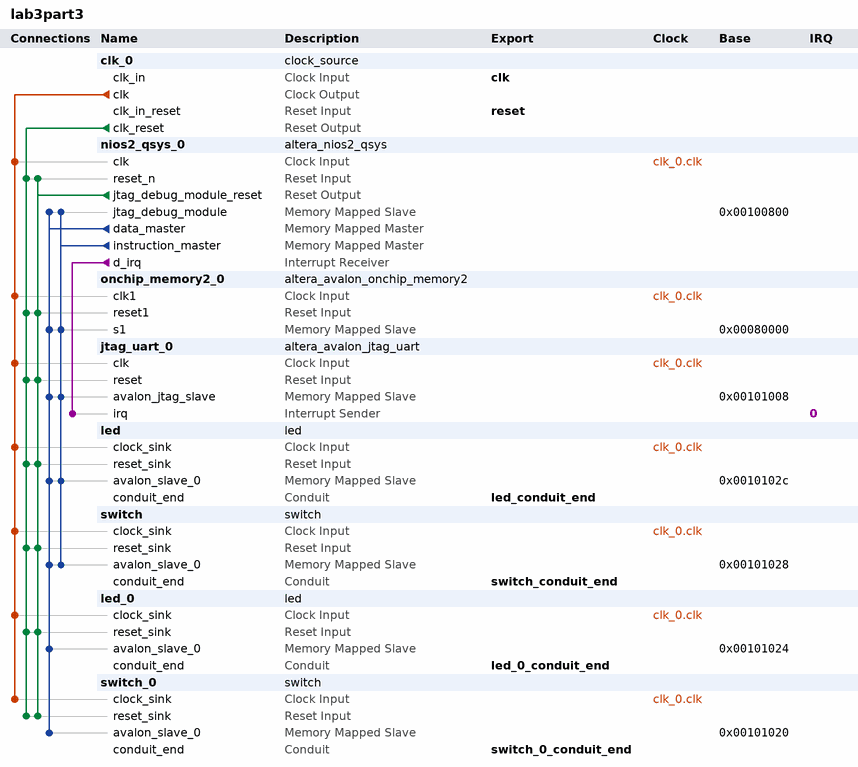
[diagram p0: system contents]
# Platform Designer (Qsys) system lab3part3, Cyclone IV E EP4CE115F29C8
# Parameters at their usual value, and those the tool derives, are not listed.
package require -exact qsys 13.0
create_system lab3part3
set_project_property DEVICE_FAMILY {Cyclone IV E}
set_project_property DEVICE EP4CE115F29C8

add_instance clk_0 clock_source 13.0
set_instance_parameter_value clk_0 clockFrequency 50000000

add_instance nios2_qsys_0 altera_nios2_qsys 13.0
set_instance_parameter_value nios2_qsys_0 resetSlave onchip_memory2_0.s1
set_instance_parameter_value nios2_qsys_0 mmu_TLBMissExcSlave None
set_instance_parameter_value nios2_qsys_0 exceptionSlave onchip_memory2_0.s1
set_instance_parameter_value nios2_qsys_0 breakSlave nios2_qsys_0.jtag_debug_module
set_instance_parameter_value nios2_qsys_0 impl Tiny
set_instance_parameter_value nios2_qsys_0 icache_size 4096

add_instance onchip_memory2_0 altera_avalon_onchip_memory2 13.0.1.99.2
set_instance_parameter_value onchip_memory2_0 dataWidth 32
set_instance_parameter_value onchip_memory2_0 dualPort false
set_instance_parameter_value onchip_memory2_0 initMemContent true
set_instance_parameter_value onchip_memory2_0 initializationFileName onchip_mem.hex
set_instance_parameter_value onchip_memory2_0 memorySize 400000

add_instance jtag_uart_0 altera_avalon_jtag_uart 13.0.1.99.2
set_instance_parameter_value jtag_uart_0 simInteractiveOptions NO_INTERACTIVE_WINDOWS

add_instance led led 1.0

add_instance switch switch 1.0

add_instance led_0 led 1.0

add_instance switch_0 switch 1.0

# connections
add_connection clk_0.clk jtag_uart_0.clk clock
add_connection clk_0.clk led.clock_sink clock
add_connection clk_0.clk led_0.clock_sink clock
add_connection clk_0.clk nios2_qsys_0.clk clock
add_connection clk_0.clk onchip_memory2_0.clk1 clock
add_connection clk_0.clk switch.clock_sink clock
add_connection clk_0.clk switch_0.clock_sink clock
add_connection clk_0.clk_reset jtag_uart_0.reset reset
add_connection clk_0.clk_reset led.reset_sink reset
add_connection clk_0.clk_reset led_0.reset_sink reset
add_connection clk_0.clk_reset nios2_qsys_0.reset_n reset
add_connection clk_0.clk_reset onchip_memory2_0.reset1 reset
add_connection clk_0.clk_reset switch.reset_sink reset
add_connection clk_0.clk_reset switch_0.reset_sink reset
add_connection nios2_qsys_0.jtag_debug_module_reset jtag_uart_0.reset reset
add_connection nios2_qsys_0.jtag_debug_module_reset led.reset_sink reset
add_connection nios2_qsys_0.jtag_debug_module_reset led_0.reset_sink reset
add_connection nios2_qsys_0.jtag_debug_module_reset nios2_qsys_0.reset_n reset
add_connection nios2_qsys_0.jtag_debug_module_reset onchip_memory2_0.reset1 reset
add_connection nios2_qsys_0.jtag_debug_module_reset switch.reset_sink reset
add_connection nios2_qsys_0.jtag_debug_module_reset switch_0.reset_sink reset
add_connection nios2_qsys_0.data_master jtag_uart_0.avalon_jtag_slave avalon
set_connection_parameter_value nios2_qsys_0.data_master/jtag_uart_0.avalon_jtag_slave baseAddress 0x00101008
add_connection nios2_qsys_0.data_master led.avalon_slave_0 avalon
set_connection_parameter_value nios2_qsys_0.data_master/led.avalon_slave_0 baseAddress 0x0010102c
add_connection nios2_qsys_0.data_master led_0.avalon_slave_0 avalon
set_connection_parameter_value nios2_qsys_0.data_master/led_0.avalon_slave_0 baseAddress 0x00101024
add_connection nios2_qsys_0.data_master nios2_qsys_0.jtag_debug_module avalon
set_connection_parameter_value nios2_qsys_0.data_master/nios2_qsys_0.jtag_debug_module baseAddress 0x00100800
add_connection nios2_qsys_0.data_master onchip_memory2_0.s1 avalon
set_connection_parameter_value nios2_qsys_0.data_master/onchip_memory2_0.s1 baseAddress 0x00080000
add_connection nios2_qsys_0.data_master switch.avalon_slave_0 avalon
set_connection_parameter_value nios2_qsys_0.data_master/switch.avalon_slave_0 baseAddress 0x00101028
add_connection nios2_qsys_0.data_master switch_0.avalon_slave_0 avalon
set_connection_parameter_value nios2_qsys_0.data_master/switch_0.avalon_slave_0 baseAddress 0x00101020
add_connection nios2_qsys_0.instruction_master jtag_uart_0.avalon_jtag_slave avalon
set_connection_parameter_value nios2_qsys_0.instruction_master/jtag_uart_0.avalon_jtag_slave baseAddress 0x00101008
add_connection nios2_qsys_0.instruction_master led.avalon_slave_0 avalon
set_connection_parameter_value nios2_qsys_0.instruction_master/led.avalon_slave_0 baseAddress 0x0010102c
add_connection nios2_qsys_0.instruction_master nios2_qsys_0.jtag_debug_module avalon
set_connection_parameter_value nios2_qsys_0.instruction_master/nios2_qsys_0.jtag_debug_module baseAddress 0x00100800
add_connection nios2_qsys_0.instruction_master onchip_memory2_0.s1 avalon
set_connection_parameter_value nios2_qsys_0.instruction_master/onchip_memory2_0.s1 baseAddress 0x00080000
add_connection nios2_qsys_0.instruction_master switch.avalon_slave_0 avalon
set_connection_parameter_value nios2_qsys_0.instruction_master/switch.avalon_slave_0 baseAddress 0x00101028
add_connection nios2_qsys_0.d_irq jtag_uart_0.irq interrupt
set_connection_parameter_value nios2_qsys_0.d_irq/jtag_uart_0.irq irqNumber 0

# exported interfaces
add_interface clk clock sink
set_interface_property clk EXPORT_OF clk_0.clk_in
add_interface reset reset sink
set_interface_property reset EXPORT_OF clk_0.clk_in_reset
add_interface switch_conduit_end conduit end
set_interface_property switch_conduit_end EXPORT_OF switch.conduit_end
add_interface led_conduit_end conduit end
set_interface_property led_conduit_end EXPORT_OF led.conduit_end
add_interface led_0_conduit_end conduit end
set_interface_property led_0_conduit_end EXPORT_OF led_0.conduit_end
add_interface switch_0_conduit_end conduit end
set_interface_property switch_0_conduit_end EXPORT_OF switch_0.conduit_end

set_interconnect_requirement {$system} qsys_mm.clockCrossingAdapter HANDSHAKE
set_interconnect_requirement {$system} qsys_mm.maxAdditionalLatency 1

save_system lab3part3.qsys
